# Altium project MasterRelayModule.PrjPcb
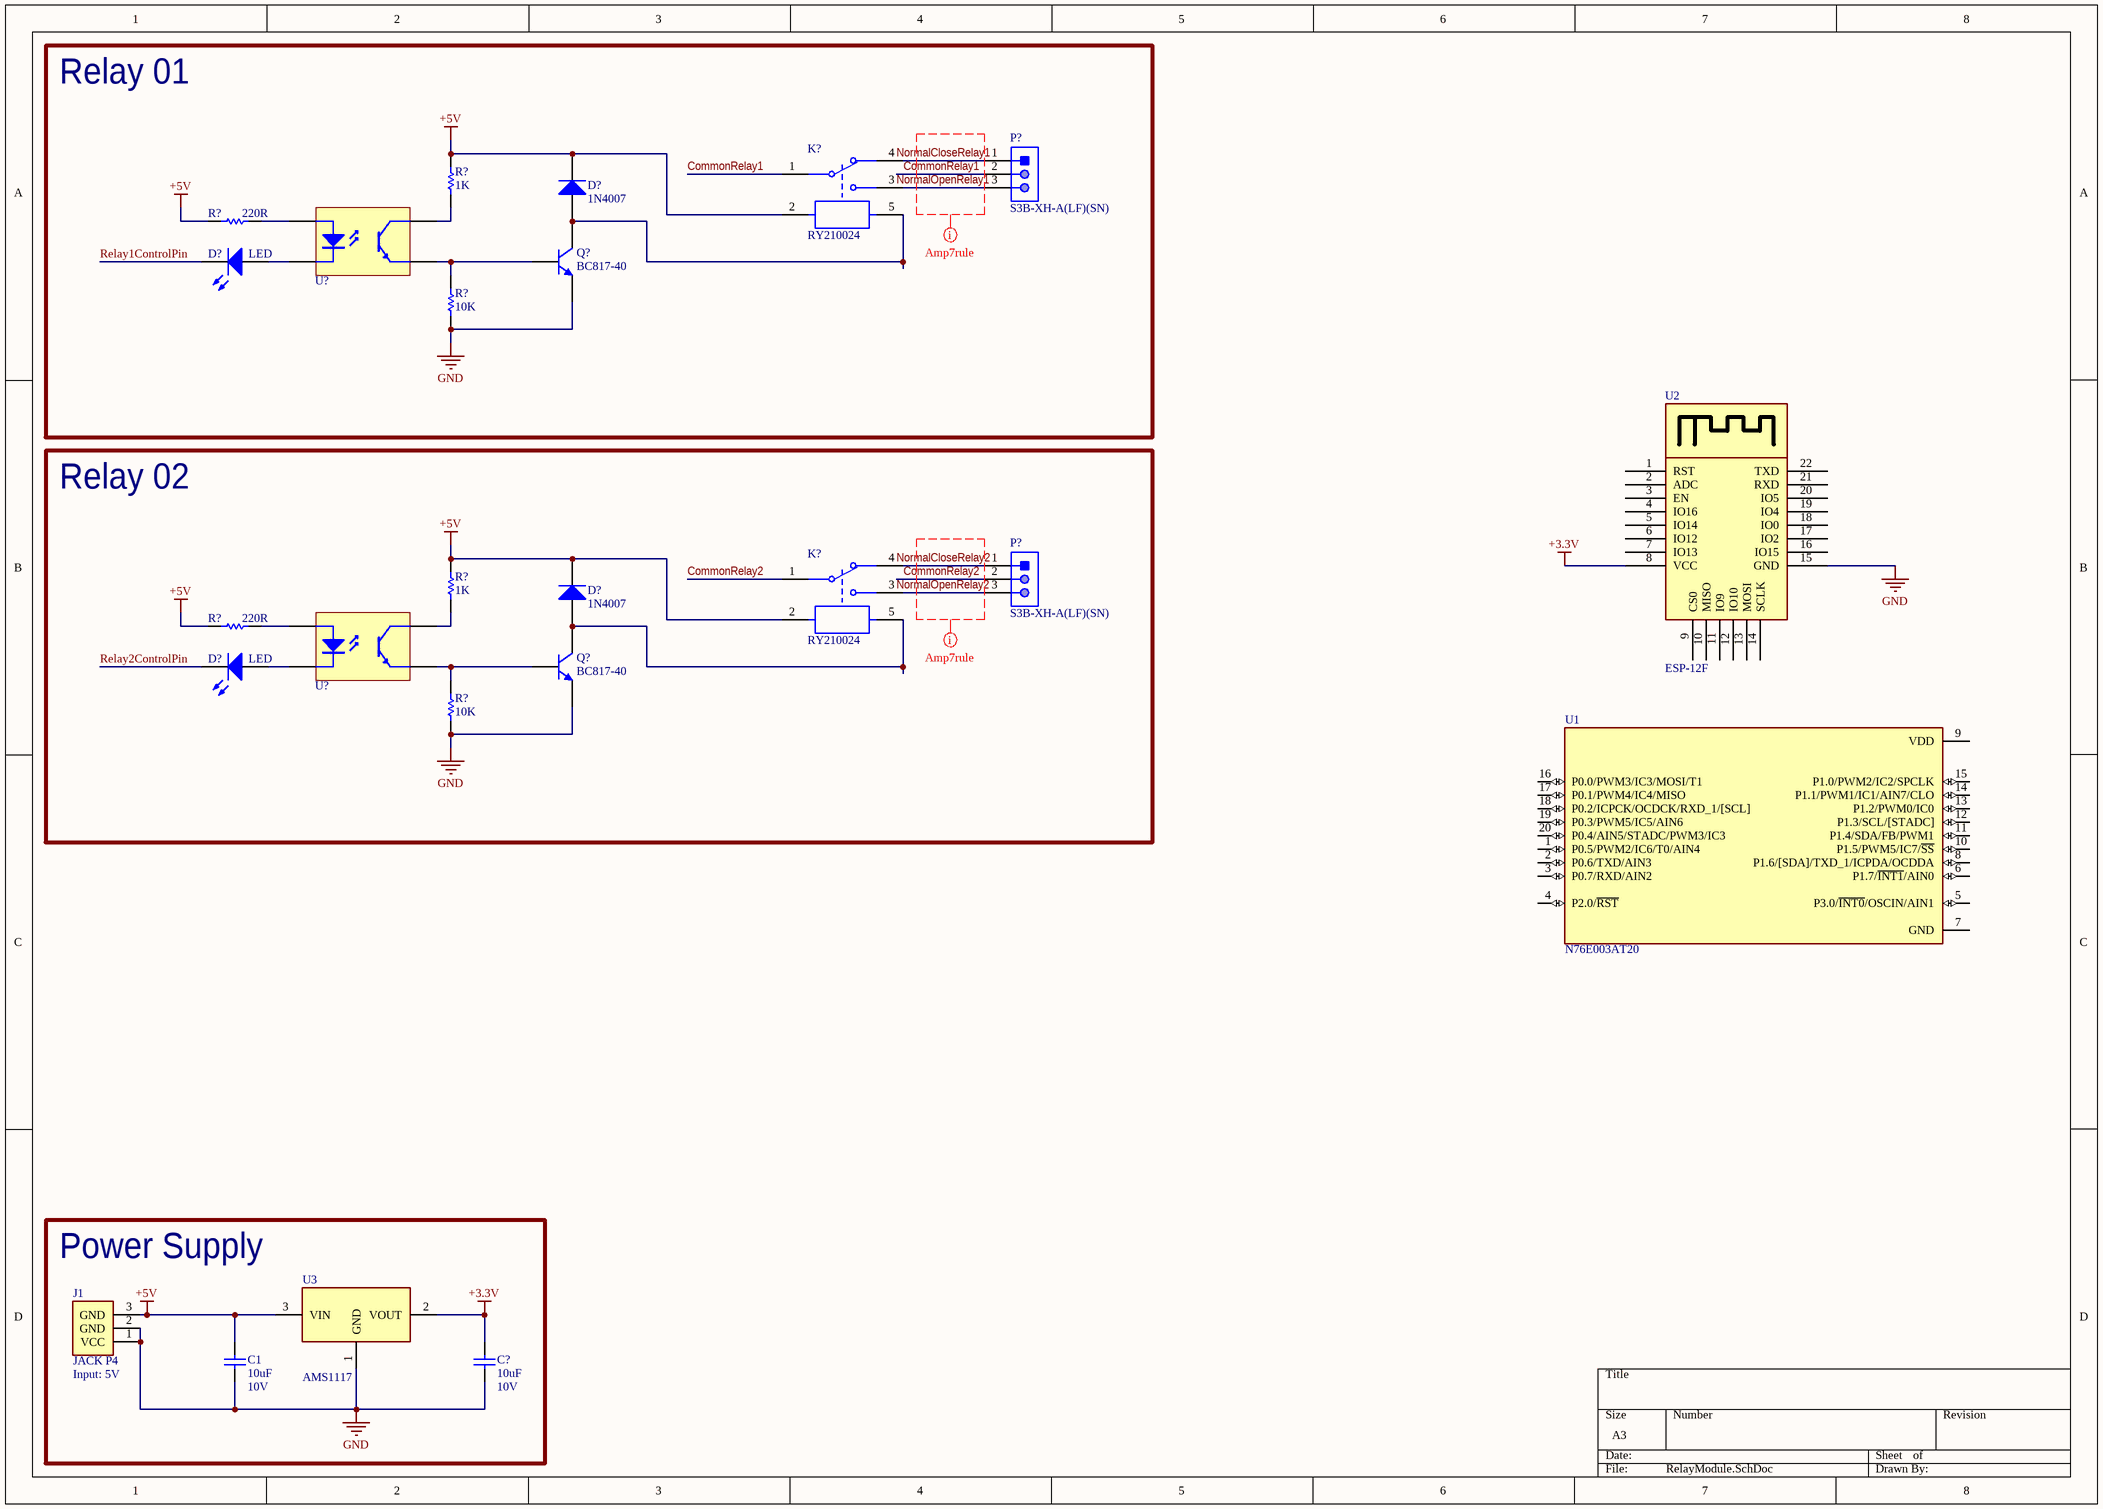
[diagram p0: RelayModule.SchDoc]
1 sheet, 24 parts. Net scope: global (net labels, ports and power ports of the same name join across sheets).
Board file: PCB1.PcbDoc

## Sheet RelayModule.SchDoc
size A3; SheetNumber: 1; SheetTotal: 1

### Parts
(Parts that share a designator on the sheet are numbered #1, #2 ... from top to bottom, then left to right.)
C1  Volte: 10V  [MY_1210]  (hidden comment: 10uF)
C?  Volte: 10V  [MY_1210]  (hidden comment: 10uF)
D?#1  1N4007  [My_DO41]
D?#2  LED  [MY_LED_0805]
D?#3  1N4007  [My_DO41]
D?#4  LED  [MY_LED_0805]
J1  JACK P4  [JACK_P4]
K?#1  RY210024  [TECO-RY210024_V]
K?#2  RY210024  [TECO-RY210024_V]
P?#1  S3B-XH-A(LF)(SN)  [JST-S3B-XH-A(LF)(SN)_V]
P?#2  S3B-XH-A(LF)(SN)  [JST-S3B-XH-A(LF)(SN)_V]
Q?#1  BC817-40  [SOT-23A_N]
Q?#2  BC817-40  [SOT-23A_N]
R?#1  1K  [MY_0805]
R?#2  220R  [MY_0805]
R?#3  10K  [MY_0805]
R?#4  1K  [MY_0805]
R?#5  220R  [MY_0805]
R?#6  10K  [MY_0805]
U1  N76E003AT20  [SOP65P640X120-20N]
U2  ESP-12F  [ESP-12F]
U3  AMS1117  [AMS1117]
U?#1  Optoisolator  [MY_OPTO_SMD4-7]  (value not drawn)
U?#2  Optoisolator  [MY_OPTO_SMD4-7]  (value not drawn)

### Blocks framed on the sheet
Relay 01: D?#1 D?#2 K?#1 P?#1 Q?#1 R?#1-R?#3 U?#1
Relay 02: D?#3 D?#4 K?#2 P?#2 Q?#2 R?#4-R?#6 U?#2
Power Supply: C1 C? J1 U3

### Nets
+3.3V: C?.2 U2.8(VCC) U3.2(VOUT)
+5V: C1.2 D?#1.K D?#3.K J1.3(GND) K?#1.2 K?#2.2 R?#1.2 R?#2.1 R?#4.2 R?#5.1 U3.3(VIN)
GND: C1.1 C?.1 J1.1(VCC) J1.2(GND) Q?#1.2(E) Q?#2.2(E) R?#3.1 R?#6.1 U2.15(GND) U3.1(GND)
CommonRelay1: K?#1.1 P?#1.2
CommonRelay2: K?#2.1 P?#2.2
Relay1ControlPin: D?#2.K
Relay2ControlPin: D?#4.K
NetD?#1_A: D?#1.A K?#1.5 Q?#1.3(C)
NetD?#2_A: D?#2.A U?#1.2(K)
NetD?#3_A: D?#3.A K?#2.5 Q?#2.3(C)
NetD?#4_A: D?#4.A U?#2.2(K)
NetK?#1_3: K?#1.3 P?#1.3
NetK?#1_4: K?#1.4 P?#1.1
NetK?#2_3: K?#2.3 P?#2.3
NetK?#2_4: K?#2.4 P?#2.1
NetQ?#1_1: Q?#1.1(B) R?#3.2 U?#1.3(E)
NetQ?#2_1: Q?#2.1(B) R?#6.2 U?#2.3(E)
NetR?#1_1: R?#1.1 U?#1.4(C)
NetR?#2_2: R?#2.2 U?#1.1(A)
NetR?#4_1: R?#4.1 U?#2.4(C)
NetR?#5_2: R?#5.2 U?#2.1(A)

Not connected (* = marked no-connect by the designer): U1 1(P0.5/PWM2/IC6/T0/AIN4) 2(P0.6/TXD/AIN3) 3(P0.7/RXD/AIN2) 4(P2.0/~{RST}) 5(P3.0/~{INT0}/OSCIN/AIN1) 6(P1.7/~{INT1}/AIN0) 7(GND) 8(P1.6/[SDA]/TXD_1/ICPDA/OCDDA) 9(VDD) 10(P1.5/PWM5/IC7/~{SS}) 11(P1.4/SDA/FB/PWM1) 12(P1.3/SCL/[STADC]) 13(P1.2/PWM0/IC0) 14(P1.1/PWM1/IC1/AIN7/CLO) 15(P1.0/PWM2/IC2/SPCLK) 16(P0.0/PWM3/IC3/MOSI/T1) 17(P0.1/PWM4/IC4/MISO) 18(P0.2/ICPCK/OCDCK/RXD_1/[SCL]) 19(P0.3/PWM5/IC5/AIN6) 20(P0.4/AIN5/STADC/PWM3/IC3); U2 1(RST) 2(ADC) 3(EN) 4(IO16) 5(IO14) 6(IO12) 7(IO13) 9(CS0) 10(MISO) 11(IO9) 12(IO10) 13(MOSI) 14(SCLK) 16(IO15) 17(IO2) 18(IO0) 19(IO4) 20(IO5) 21(RXD) 22(TXD)

### Layout directives
rule Width Constraint [Pref Width = 80mil    Min Width = 80mil    Max Width = 160mil]: (no net found under the mark)

### Notes on the sheet
- (near J1) Input: 5V
- Labels drawn without touching a wire or pin: NormalCloseRelay1, NormalCloseRelay2, NormalOpenRelay1, NormalOpenRelay2

### Library data of the parts
C1 C? = Cap ceramic: None polar capacitor; ASiD Part Number: C-AS; Value: 10uF
D?#1 D?#3 = 1N4007: 1 Amp Diode; ASiD Part Number: 1n4007-AS
D?#2 D?#4 = LED: Typical INFRARED GaAs LED; ASiD Part Number: LED-AS
J1 = JACK_P4: 9V Battery Connector Jack P4.
K?#1 K?#2 = CMP-008-00004-4: General Purpose Relay, 24 VDC, 8 A, -40 to 70 degC, 5-Pin THD, RoHS, Bulk; Manufacturer: TE Connectivity; Operate Time: 9ms; Contact Form: SPDT; Current Rating: 10A; Datasheet URL: http://www.te.com/commerce/DocumentDelivery/DDEController?Action=showdoc&DocId=Data+Sheet%7FRYII%7F0115%7Fpdf%7FEnglish%7FENG_DS_RYII_0115.pdf%7F3-1393224-8; Datasheet Version: Rev. 0115, 01/2015; Max Operating Temperature: 70°C; Mounting Technology: ThroughHole; Min Operating Temperature: -40°C; Package Description: 5-Pin Through Hole Device, Body 28.5 x 10.1 mm; Pins: 5; Package Reference: RY210024; RoHS Compliant: True
P?#1 P?#2 = CMP-002-00033-2: Male Header, Pitch 2.5 mm, 1 x 3 Position, Height 6.1 mm, Tail Length 3.4 mm, -25 to 85 degC, RoHS, Bulk; Manufacturer: JST; Package Description: Male Header, Pitch 2.5 mm, 1 x 3 Position, Height 6.1 mm, Tail Length 3.4 mm; Manufacturer URL: http://www.jst.com/home2.html; Datasheet URL: http://www.jst-mfg.com/product/pdf/eng/eXH.pdf; RoHS Compliant: Unknown; Connector Type: Header; Package Reference: S3B-XH-A(LF)(SN); Gender: Male; Case/Package: S3B-XH-A(LF)(SN); Mounting Technology: TH; Max Operating Temperature: 85°C; Min Operating Temperature: -25°C; Datasheet Version: May-16
Q?#1 Q?#2 = BC817-40: NPN General Purpose Amplifier; Published: 8-Jun-2000; LatestRevisionDate: 20-Nov-2009; LatestRevisionNote: IPC-7351 Footprint Added.; DatasheetVersion: 1997; PackageVersion: Sep-1998; PackageReference: SOT-23A; Publisher: Altium Limited; PackageDescription: 3-Pin SOT-23 Package 0.95 mm Pitch, 2.3 mm Lead Span; ComponentLink1Description: Manufacturer Link; ComponentLink1URL: http://www.fairchildsemi.com/; ComponentLink2Description: Discontinuation Notice; ComponentLink2URL: http://www.fairchildsemi.com/obsolete/obs.jsp
R?#1-R?#6 = Res: Standard resistor; ASiD Part Number: Res-AS
  R?#1 R?#4: Value: 1K
  R?#2 R?#5: Value: 220R
  R?#3 R?#6: Value: 10K
U1 = N76E003AT20: 8051 Mcu, Shape: t; MF: Nuvoton; MP: N76E003AT20-T; SnapEDA_Link: https://www.snapeda.com/parts/N76E003AT20-T/Nuvoton/view-part/?ref=snap; Package: None; Value: *; Check_prices: https://www.snapeda.com/parts/N76E003AT20-T/Nuvoton/view-part/?ref=eda
U2 = ESP-12F: Chip SMD 22 Pads Wifi 2.4GHz BLE 4.2 16x24mm w/ Antenna.; ComponentLink1Description: Datasheet; ComponentLink1URL: https://docs.ai-thinker.com/_media/esp8266/docs/esp-12f_product_specification_en.pdf; JLCPCB PN: C82891
U3 = AMS1117: IC REG LINEAR 1A SOT-89-3L; ComponentLink1Description: Datasheet; ComponentLink1URL: http://www.advanced-monolithic.com/pdf/ds1117.pdf; Digikey PN: 4518-AMS1117-3.3CT-ND; JLCPCB PN: C963410
U?#1 U?#2 = Optoisolator: ASiD Part Number: Optoisolator-AS